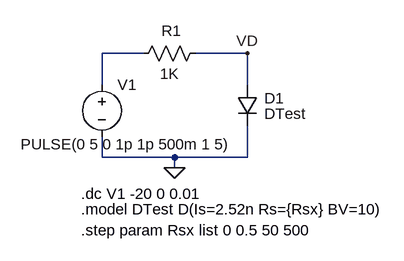
[diagram p0: schematic 3_12_tp2_ej5_pablo_gomez.asc]
3_12_tp2_ej5_pablo_gomez.asc, the LTspice schematic file:
Version 4
SHEET 1 880 680
WIRE 80 48 16 48
WIRE 240 48 160 48
WIRE 16 96 16 48
WIRE 240 96 240 48
WIRE 16 208 16 176
WIRE 128 208 16 208
WIRE 240 208 240 160
WIRE 240 208 128 208
WIRE 128 224 128 208
FLAG 128 224 0
FLAG 240 48 VD
SYMBOL diode 224 96 R0
WINDOW 3 42 45 Left 2
WINDOW 0 42 21 Left 2
SYMATTR Value DTest
SYMATTR InstName D1
SYMBOL res 64 64 R270
WINDOW 0 35 59 VTop 2
WINDOW 3 0 56 VBottom 2
SYMATTR InstName R1
SYMATTR Value 1K
SYMATTR SpiceLine tol=1 pwr=0.1
SYMBOL voltage 16 80 R0
WINDOW 3 -125 108 Left 2
WINDOW 123 0 0 Left 0
WINDOW 39 0 0 Left 0
SYMATTR Value PULSE(0 5 0 1p 1p 500m 1 5)
SYMATTR InstName V1
TEXT -16 264 Left 2 !.dc V1 -20 0 0.01
TEXT -16 288 Left 2 !.model DTest D(Is=2.52n Rs={Rsx} BV=10)
TEXT -16 320 Left 2 !.step param Rsx list 0 0.5 50 500

The netlist it stands for:
* 3_12_tp2_ej5_pablo_gomez.asc
D1 VD 0 DTest
R1 N001 VD 1K tol=1 pwr=0.1
V1 N001 0 PULSE(0 5 0 1p 1p 500m 1 5)
.model D D
.lib standard.dio
.dc V1 -20 0 0.01
.model DTest D(Is=2.52n Rs={Rsx} BV=10)
.step param Rsx list 0 0.5 50 500
.backanno
.end